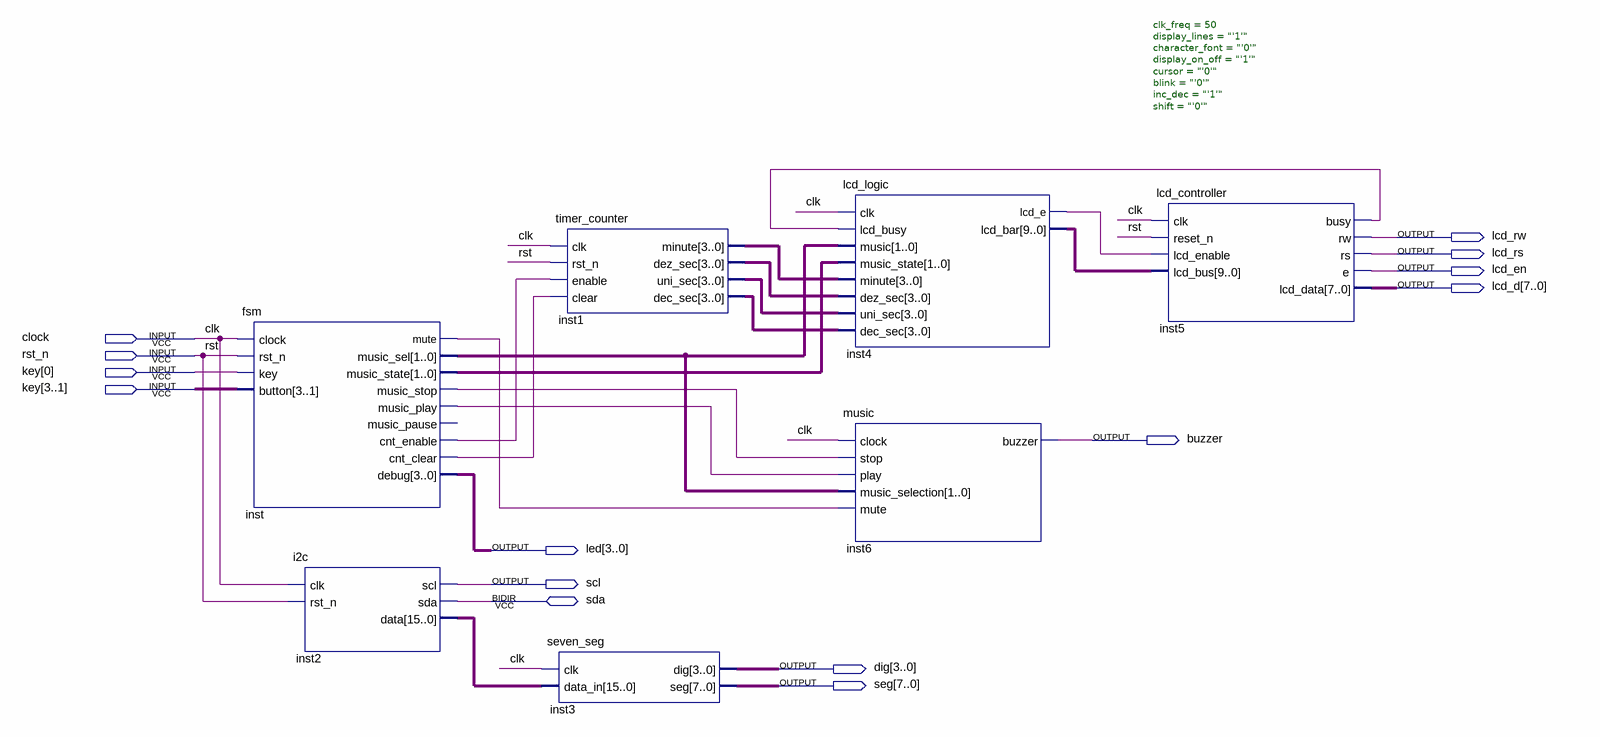
[diagram p0: schematic sheet]
// Quartus schematic subtop_test.bdf as structural Verilog: 7 symbols, 14 pins
module subtop_test (
  input  clock,
  input  rst_n,
  input  [3:0] key,
  inout  sda,
  output lcd_rw,
  output lcd_rs,
  output lcd_en,
  output [7:0] lcd_d,
  output buzzer,
  output [3:0] led,
  output scl,
  output [3:0] dig,
  output [7:0] seg
);

  wire inst4_lcd_e, inst5_busy, inst_cnt_clear, inst_cnt_enable, inst_music_play, inst_music_stop, inst_mute;
  wire [1:0] inst_music_sel, inst_music_state;
  wire [3:0] inst1_dec_sec, inst1_dez_sec, inst1_minute, inst1_uni_sec;
  wire [9:0] inst4_lcd_bar;
  wire [15:0] inst2_data;

  fsm inst (
    .clock(clock), .rst_n(rst_n), .key(key[0]), .button(key[3:1]), .mute(inst_mute),
    .music_sel(inst_music_sel), .music_state(inst_music_state), .music_stop(inst_music_stop),
    .music_play(inst_music_play), .cnt_enable(inst_cnt_enable), .cnt_clear(inst_cnt_clear), .debug(led));  // open: music_pause
  i2c inst2 (.clk(clock), .rst_n(rst_n), .scl(scl), .data(inst2_data), .sda(sda));
  timer_counter inst1 (
    .clk(clock), .rst_n(rst_n), .enable(inst_cnt_enable), .clear(inst_cnt_clear), .minute(inst1_minute),
    .dez_sec(inst1_dez_sec), .uni_sec(inst1_uni_sec), .dec_sec(inst1_dec_sec));
  seven_seg inst3 (.clk(clock), .data_in(inst2_data), .dig(dig), .seg(seg));
  lcd_logic inst4 (
    .clk(clock), .lcd_busy(inst5_busy), .music(inst_music_sel), .music_state(inst_music_state),
    .minute(inst1_minute), .dez_sec(inst1_dez_sec), .uni_sec(inst1_uni_sec), .dec_sec(inst1_dec_sec),
    .lcd_e(inst4_lcd_e), .lcd_bar(inst4_lcd_bar));
  music inst6 (
    .clock(clock), .stop(inst_music_stop), .play(inst_music_play), .music_selection(inst_music_sel),
    .mute(inst_mute), .buzzer(buzzer));
  lcd_controller #(.clk_freq(50), .display_lines("'1'"), .character_font("'0'"), .display_on_off("'1'"), .cursor("'0'"), .blink("'0'"), .inc_dec("'1'"), .shift("'0'")) inst5 (
    .clk(clock), .reset_n(rst_n), .lcd_enable(inst4_lcd_e), .lcd_bus(inst4_lcd_bar), .busy(inst5_busy),
    .rw(lcd_rw), .rs(lcd_rs), .e(lcd_en), .lcd_data(lcd_d));

  // Other names for the same wires on the sheet: clk = clock; rst = rst_n
endmodule
